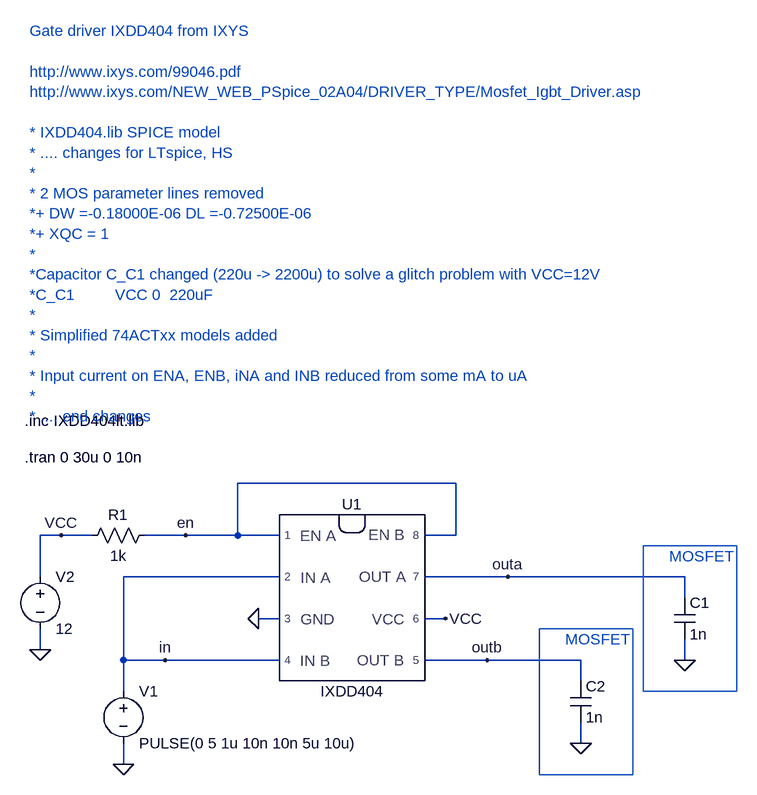
[diagram p0: schematic IXDD404_test.asc]
IXDD404_test.asc, the LTspice schematic file:
Version 4
SHEET 1 1100 680
WIRE -304 240 -304 176
WIRE -304 352 -304 320
WIRE -272 176 -304 176
WIRE -224 176 -272 176
WIRE -176 368 -176 240
WIRE -176 416 -176 368
WIRE -176 528 -176 496
WIRE -112 368 -176 368
WIRE -80 176 -144 176
WIRE 0 176 -80 176
WIRE 0 176 0 96
WIRE 64 176 0 176
WIRE 64 240 -176 240
WIRE 64 304 32 304
WIRE 64 368 -112 368
WIRE 320 304 288 304
WIRE 336 96 0 96
WIRE 336 176 288 176
WIRE 336 176 336 96
WIRE 384 368 288 368
WIRE 416 240 288 240
WIRE 528 368 384 368
WIRE 528 400 528 368
WIRE 528 496 528 464
WIRE 688 240 416 240
WIRE 688 272 688 240
WIRE 688 368 688 336
FLAG 32 304 0
FLAG 320 304 VCC
FLAG -304 352 0
FLAG 688 368 0
FLAG 528 496 0
FLAG -176 528 0
FLAG -272 176 VCC
FLAG -80 176 en
FLAG -112 368 in
FLAG 416 240 outa
FLAG 384 368 outb
SYMBOL ixdd404 176 272 R0
SYMATTR InstName U1
SYMBOL res -240 192 R270
WINDOW 0 32 56 VTop 0
WINDOW 3 0 56 VBottom 0
SYMATTR InstName R1
SYMATTR Value 1k
SYMBOL voltage -176 400 R0
WINDOW 123 0 0 Left 0
WINDOW 39 0 0 Left 0
SYMATTR InstName V1
SYMATTR Value PULSE(0 5 1u 10n 10n 5u 10u)
SYMBOL voltage -304 224 R0
SYMATTR InstName V2
SYMATTR Value 12
SYMBOL cap 672 272 R0
SYMATTR InstName C1
SYMATTR Value 1n
SYMBOL cap 512 400 R0
SYMATTR InstName C2
SYMATTR Value 1n
TEXT -328 56 Left 0 !.tran 0 30u 0 10n
TEXT -328 0 Left 0 !.inc IXDD404lt.lib
TEXT -320 -600 Left 0 ;Gate driver IXDD404 from IXYS\n \nhttp://www.ixys.com/99046.pdf\nhttp://www.ixys.com/NEW_WEB_PSpice_02A04/DRIVER_TYPE/Mosfet_Igbt_Driver.asp\n \n* IXDD404.lib SPICE model \n* .... changes for LTspice, HS\n*\n* 2 MOS parameter lines removed \n*+ DW =-0.18000E-06 DL =-0.72500E-06\n*+ XQC = 1\n*\n*Capacitor C_C1 changed (220u -> 2200u) to solve a glitch problem with VCC=12V\n*C_C1         VCC 0  220uF  \n*\n* Simplified 74ACTxx models added\n*\n* Input current on ENA, ENB, iNA and INB reduced from some mA to uA\n*\n* .... end changes
TEXT 664 208 Left 0 ;MOSFET
TEXT 504 336 Left 0 ;MOSFET
RECTANGLE Normal 768 416 624 192
RECTANGLE Normal 608 544 464 320

The netlist it stands for:
* IXDD404_test.asc
XU1 en in 0 in en outa VCC outb IXDD404  ; pins 1 2 3 4 8 7 6 5
R1 VCC en 1k
V1 in 0 PULSE(0 5 1u 10n 10n 5u 10u)
V2 VCC 0 12
C1 outa 0 1n
C2 outb 0 1n
.tran 0 30u 0 10n
.inc IXDD404lt.lib
* Gate driver IXDD404 from IXYS
* http://www.ixys.com/99046.pdf
* http://www.ixys.com/NEW_WEB_PSpice_02A04/DRIVER_TYPE/Mosfet_Igbt_Driver.asp
* * IXDD404.lib SPICE model
* * .... changes for LTspice, HS
* *
* * 2 MOS parameter lines removed
* *+ DW =-0.18000E-06 DL =-0.72500E-06
* *+ XQC = 1
* *
* *Capacitor C_C1 changed (220u -> 2200u) to solve a glitch problem with VCC=12V
* *C_C1         VCC 0  220uF
* *
* * Simplified 74ACTxx models added
* *
* * Input current on ENA, ENB, iNA and INB reduced from some mA to uA
* *
* * .... end changes
* MOSFET
* MOSFET
.backanno
.end